# EAGLE design RaspiOMix+ (EAGLE 7.2.0)
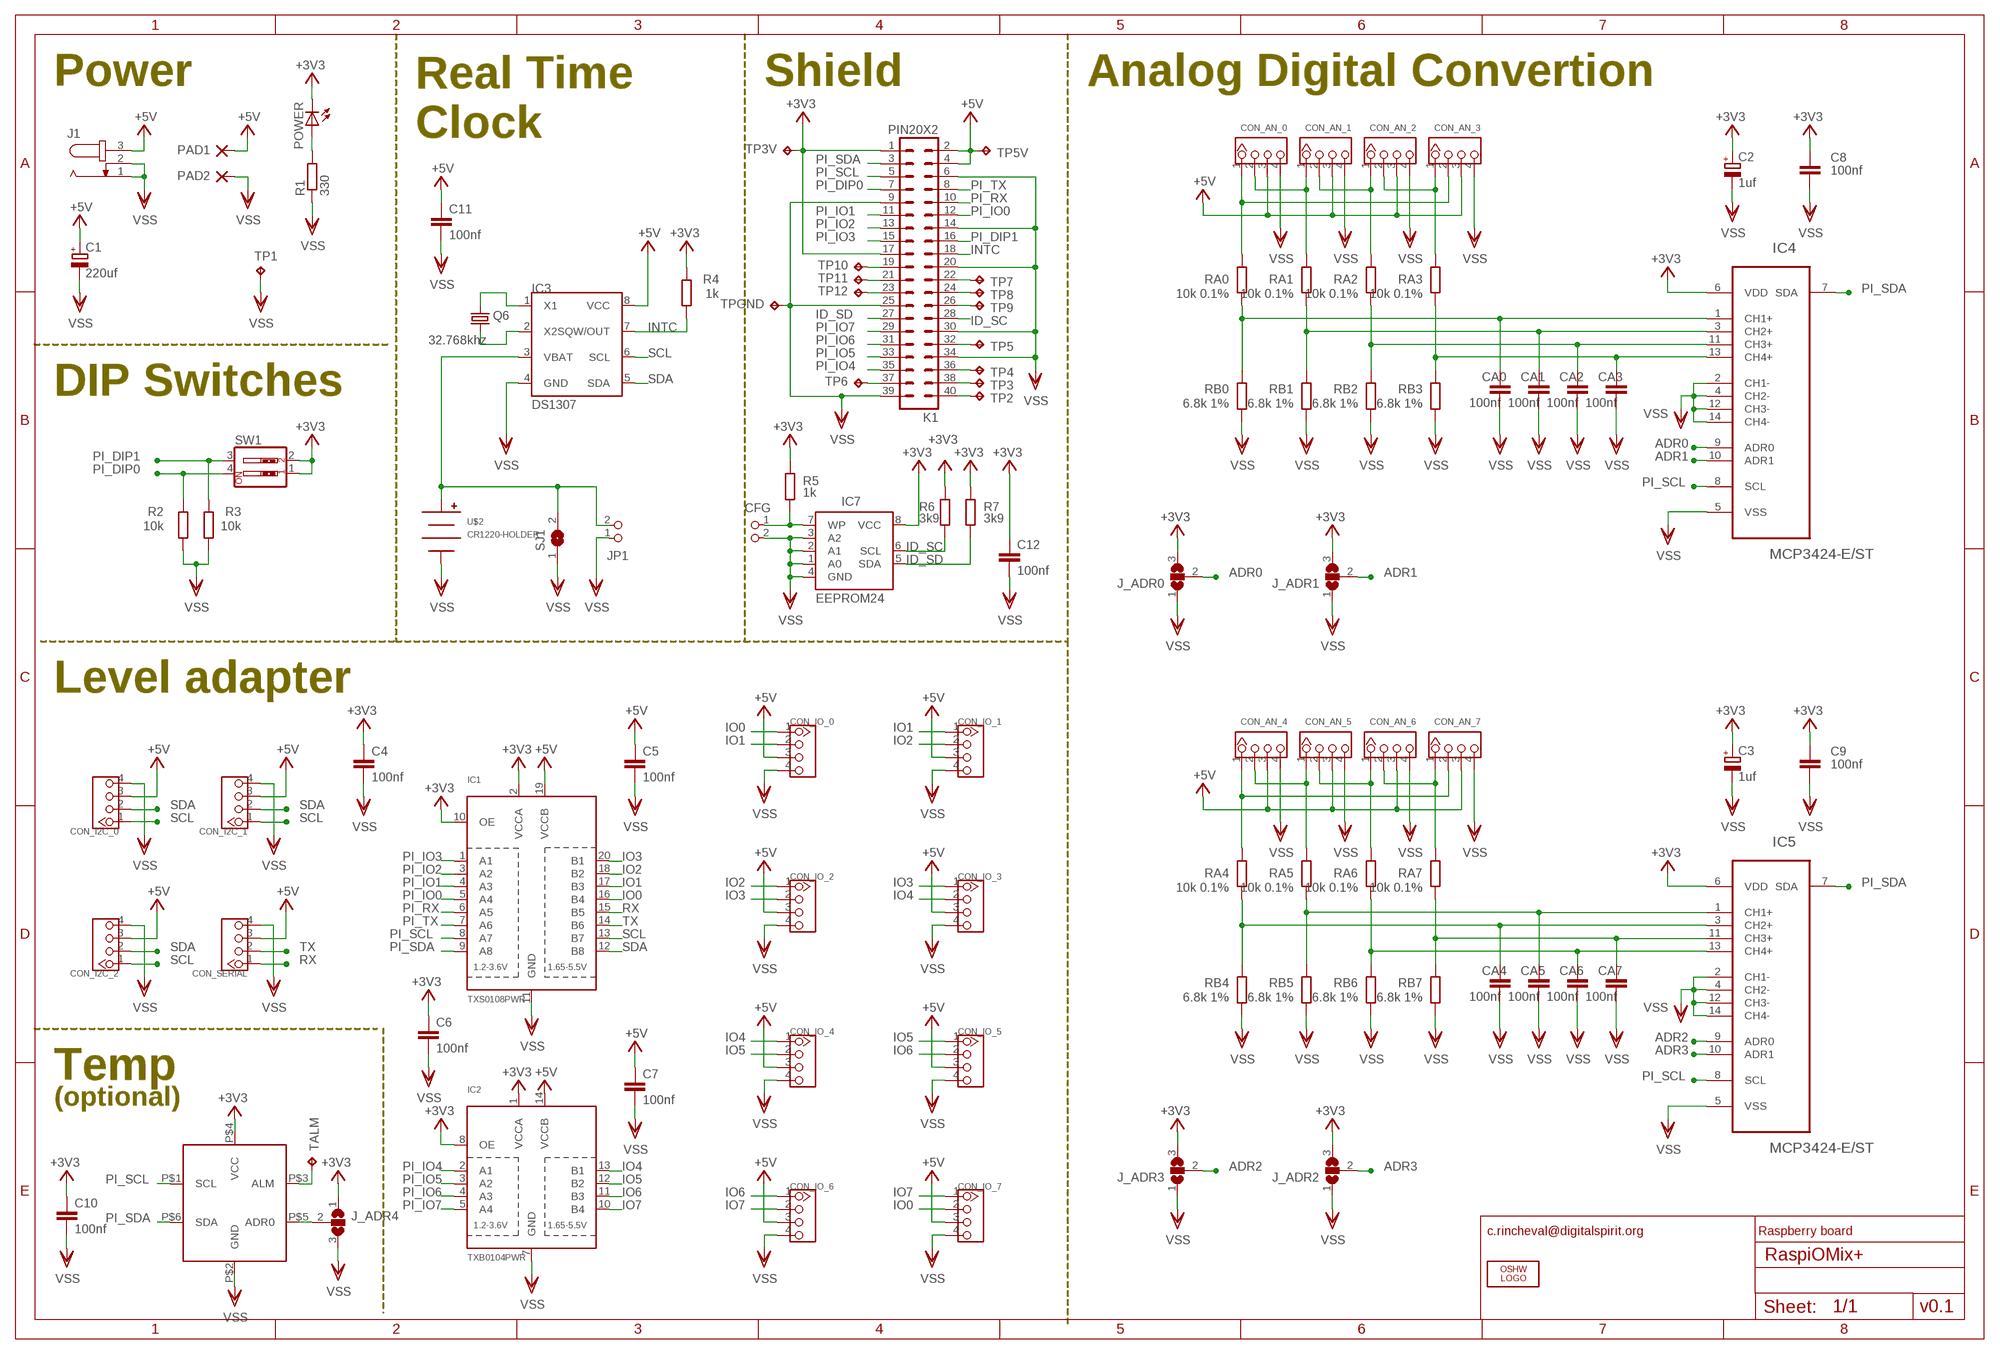
[diagram p0: schematic, sheet 1]

## Parts
C1  220uf  CPOL-EUD  [PANASONIC_D]
C2  1uf  CPOL-EUB/3528-21R  [B/3528-21R]
C3  1uf  CPOL-EUB/3528-21R  [B/3528-21R]
C4  100nf  C-EUC0805  [C0805]
C5  100nf  C-EUC0805  [C0805]
C6  100nf  C-EUC0805  [C0805]
C7  100nf  C-EUC0805  [C0805]
C8  100nf  C-EUC0805  [C0805]
C9  100nf  C-EUC0805  [C0805]
C10  100nf  C-EUC0805  [C0805]
C11  100nf  C-EUC0805  [C0805]
C12  100nf  C-EUC0805K  [C0805K]
CA0  100nf  C-EUC0805  [C0805]
CA1  100nf  C-EUC0805  [C0805]
CA2  100nf  C-EUC0805  [C0805]
CA3  100nf  C-EUC0805  [C0805]
CA4  100nf  C-EUC0805  [C0805]
CA5  100nf  C-EUC0805  [C0805]
CA6  100nf  C-EUC0805  [C0805]
CA7  100nf  C-EUC0805  [C0805]
CFG  PIN2_100  [PIN_W_2]
CON_AN_0  TWIG-4P-2.0-2.0  [4P-2.0]
CON_AN_1  TWIG-4P-2.0-2.0  [4P-2.0]
CON_AN_2  TWIG-4P-2.0-2.0  [4P-2.0]
CON_AN_3  TWIG-4P-2.0-2.0  [4P-2.0]
CON_AN_4  TWIG-4P-2.0-2.0  [4P-2.0]
CON_AN_5  TWIG-4P-2.0-2.0  [4P-2.0]
CON_AN_6  TWIG-4P-2.0-2.0  [4P-2.0]
CON_AN_7  TWIG-4P-2.0-2.0  [4P-2.0]
CON_I2C_0  TWIG-4P-2.0-2.0  [4P-2.0]
CON_I2C_1  TWIG-4P-2.0-2.0  [4P-2.0]
CON_I2C_2  TWIG-4P-2.0-2.0  [4P-2.0]
CON_IO_0  TWIG-4P-2.0-2.0  [4P-2.0]
CON_IO_1  TWIG-4P-2.0-2.0  [4P-2.0]
CON_IO_2  TWIG-4P-2.0-2.0  [4P-2.0]
CON_IO_3  TWIG-4P-2.0-2.0  [4P-2.0]
CON_IO_4  TWIG-4P-2.0-2.0  [4P-2.0]
CON_IO_5  TWIG-4P-2.0-2.0  [4P-2.0]
CON_IO_6  TWIG-4P-2.0-2.0  [4P-2.0]
CON_IO_7  TWIG-4P-2.0-2.0  [4P-2.0]
CON_SERIAL  TWIG-4P-2.0-2.0  [4P-2.0]
IC1  TXS0108PWR  TXB0108PWR  [TSSOP20]
IC2  TXB0104PWR  [TSSOP14]
IC3  DS1307  [SOIC-8]
IC4  MCP3424-E/ST  [SOP65P640X120-14N]
IC5  MCP3424-E/ST  [SOP65P640X120-14N]
IC6  TMP101  [SOT23-6]
IC7  EEPROM24  [SOIC8]
J1  JACK-PLUG0  [SPC4077]
J_ADR0  SJ2W  [SJ_2]
J_ADR1  SJ2W  [SJ_2]
J_ADR2  SJ2W  [SJ_2]
J_ADR3  SJ2W  [SJ_2]
J_ADR4  SJ2W  [SJ_2]
JP1  PIN2_100  [PIN_W_2]
K1  PIN20X2  [PIN_20X2]
LOGO1  OSHW_LOGO_FILLX0350-NT  [OSHW_FILLX350_NOTEXT]
PAD1  WIREPAD3,17/1,3  [3,17/1,3]
PAD2  WIREPAD3,17/1,3  [3,17/1,3]
POWER  LEDCHIPLED_0805  [CHIPLED_0805]
Q6  32.768khz  CRYSTALTC26H  [TC26H]
R1  330  R-EU_M0805  [M0805]
R2  10k  R-EU_M0805  [M0805]
R3  10k  R-EU_M0805  [M0805]
R4  1k  R-EU_M0805  [M0805]
R5  1k  R-EU_M0805  [M0805]
R6  3k9  R-EU_M0805  [M0805]
R7  3k9  R-EU_M0805  [M0805]
RA0  10k 0.1%  R-EU_M0805  [M0805]
RA1  10k 0.1%  R-EU_M0805  [M0805]
RA2  10k 0.1%  R-EU_M0805  [M0805]
RA3  10k 0.1%  R-EU_M0805  [M0805]
RA4  10k 0.1%  R-EU_M0805  [M0805]
RA5  10k 0.1%  R-EU_M0805  [M0805]
RA6  10k 0.1%  R-EU_M0805  [M0805]
RA7  10k 0.1%  R-EU_M0805  [M0805]
RB0  6.8k 1%  R-EU_M0805  [M0805]
RB1  6.8k 1%  R-EU_M0805  [M0805]
RB2  6.8k 1%  R-EU_M0805  [M0805]
RB3  6.8k 1%  R-EU_M0805  [M0805]
RB4  6.8k 1%  R-EU_M0805  [M0805]
RB5  6.8k 1%  R-EU_M0805  [M0805]
RB6  6.8k 1%  R-EU_M0805  [M0805]
RB7  6.8k 1%  R-EU_M0805  [M0805]
SJ1  SJ  [SJ]
SW1  SW_DIP-2  [EDG-02]
TALM  TPTP12R  [TP12R]
TP1  TPPAD1-13  [P1-13]
TP2  TPTP12R  [TP12R]
TP3  TPTP12R  [TP12R]
TP3V  TPTP12R  [TP12R]
TP4  TPTP12R  [TP12R]
TP5  TPTP12R  [TP12R]
TP5V  TPTP12R  [TP12R]
TP6  TPTP12R  [TP12R]
TP7  TPTP12R  [TP12R]
TP8  TPTP12R  [TP12R]
TP9  TPTP12R  [TP12R]
TP10  TPTP12R  [TP12R]
TP11  TPTP12R  [TP12R]
TP12  TPTP12R  [TP12R]
TPGND  TPTP12R  [TP12R]
U$2  CR1220-HOLDER  [HARWIN-CR1220]

## Nets
+3V3: C2.+ C3.+ C4.1 C6.1 C8.2 C9.2 C10.1 C12.1 IC1.2(VCCA) IC1.10(OE) IC2.1(VCCA) IC2.8(OE) IC4.6(VDD) IC5.6(VDD) IC6.P$4(VCC) IC7.8(VCC) J_ADR0.3 J_ADR1.3 J_ADR2.3 J_ADR3.3 J_ADR4.1 K1.1 K1.17 POWER.C R4.2 R5.2 R6.2 R7.2 SW1.1 SW1.2 TP3V.TP
+5V: C1.+ C5.1 C7.1 C11.1 CON_AN_0.3 CON_AN_1.3 CON_AN_2.3 CON_AN_3.3 CON_AN_4.3 CON_AN_5.3 CON_AN_6.3 CON_AN_7.3 CON_I2C_0.3 CON_I2C_1.3 CON_I2C_2.3 CON_IO_0.3 CON_IO_1.3 CON_IO_2.3 CON_IO_3.3 CON_IO_4.3 CON_IO_5.3 CON_IO_6.3 CON_IO_7.3 CON_SERIAL.3 IC1.19(VCCB) IC2.14(VCCB) IC3.8(VCC) J1.3 K1.2 K1.4 PAD1.1(P) TP5V.TP
ADR0: IC4.9(ADR0) J_ADR0.2
ADR1: IC4.10(ADR1) J_ADR1.2
ADR2: IC5.9(ADR0) J_ADR3.2
ADR3: IC5.10(ADR1) J_ADR2.2
AN0: CON_AN_0.1 CON_AN_3.2 RA0.2
AN1: CON_AN_0.2 CON_AN_1.1 RA1.2
AN2: CON_AN_1.2 CON_AN_2.1 RA2.2
AN3: CON_AN_2.2 CON_AN_3.1 RA3.2
AN4: CON_AN_4.1 CON_AN_7.2 RA4.2
AN5: CON_AN_4.2 CON_AN_5.1 RA5.2
AN6: CON_AN_5.2 CON_AN_6.1 RA6.2
AN7: CON_AN_6.2 CON_AN_7.1 RA7.2
ID_SC: IC7.6(SCL) K1.28 R6.1
ID_SD: IC7.5(SDA) K1.27 R7.1
INTC: IC3.7(SQW/OUT) K1.18 R4.1
IO0: CON_IO_0.1 CON_IO_7.2 IC1.16(B4)
IO1: CON_IO_0.2 CON_IO_1.1 IC1.17(B3)
IO2: CON_IO_1.2 CON_IO_2.1 IC1.18(B2)
IO3: CON_IO_2.2 CON_IO_3.1 IC1.20(B1)
IO4: CON_IO_3.2 CON_IO_4.1 IC2.13(B1)
IO5: CON_IO_4.2 CON_IO_5.1 IC2.12(B2)
IO6: CON_IO_5.2 CON_IO_6.1 IC2.11(B3)
IO7: CON_IO_6.2 CON_IO_7.1 IC2.10(B4)
N$1: K1.40 TP2.TP
N$2: K1.38 TP3.TP
N$3: CFG.1 IC7.7(WP) R5.1
N$4: CA3.1 IC4.13(CH4+) RA3.1 RB3.2
N$5: CA2.1 IC4.11(CH3+) RA2.1 RB2.2
N$6: CA1.1 IC4.3(CH2+) RA1.1 RB1.2
N$7: CA0.1 IC4.1(CH1+) RA0.1 RB0.2
N$8: CA7.1 IC5.11(CH3+) RA7.1 RB7.2
N$9: CA6.1 IC5.13(CH4+) RA6.1 RB6.2
N$10: CA5.1 IC5.1(CH1+) RA5.1 RB5.2
N$11: CA4.1 IC5.3(CH2+) RA4.1 RB4.2
N$12: K1.36 TP4.TP
N$13: K1.32 TP5.TP
N$14: K1.37 TP6.TP
N$15: K1.22 TP7.TP
N$16: K1.24 TP8.TP
N$17: K1.26 TP9.TP
N$18: K1.19 TP10.TP
N$19: K1.21 TP11.TP
N$20: K1.23 TP12.TP
N$21: IC6.P$5(ADR0) J_ADR4.2
N$22: IC6.P$3(ALM) TALM.TP
N$33: IC3.1(X1) Q6.1
N$34: IC3.2(X2) Q6.2
N$39: POWER.A R1.2
N$58: IC3.3(VBAT) JP1.2 SJ1.2 U$2.POS
PI_DIP0: K1.7 R2.2 SW1.4
PI_DIP1: K1.16 R3.2 SW1.3
PI_IO0: IC1.5(A4) K1.12
PI_IO1: IC1.4(A3) K1.11
PI_IO2: IC1.3(A2) K1.13
PI_IO3: IC1.1(A1) K1.15
PI_IO4: IC2.2(A1) K1.35
PI_IO5: IC2.3(A2) K1.33
PI_IO6: IC2.4(A3) K1.31
PI_IO7: IC2.5(A4) K1.29
PI_RX: IC1.6(A5) K1.10
PI_SCL: IC1.8(A7) IC4.8(SCL) IC5.8(SCL) IC6.P$1(SCL) K1.5
PI_SDA: IC1.9(A8) IC4.7(SDA) IC5.7(SDA) IC6.P$6(SDA) K1.3
PI_TX: IC1.7(A6) K1.8
RX: CON_SERIAL.1 IC1.15(B5)
SCL: CON_I2C_0.1 CON_I2C_1.1 CON_I2C_2.1 IC1.13(B7) IC3.6(SCL)
SDA: CON_I2C_0.2 CON_I2C_1.2 CON_I2C_2.2 IC1.12(B8) IC3.5(SDA)
TX: CON_SERIAL.2 IC1.14(B6)
VSS: C1.- C2.- C3.- C4.2 C5.2 C6.2 C7.2 C8.1 C9.1 C10.2 C11.2 C12.2 CA0.2 CA1.2 CA2.2 CA3.2 CA4.2 CA5.2 CA6.2 CA7.2 CFG.2 CON_AN_0.4 CON_AN_1.4 CON_AN_2.4 CON_AN_3.4 CON_AN_4.4 CON_AN_5.4 CON_AN_6.4 CON_AN_7.4 CON_I2C_0.4 CON_I2C_1.4 CON_I2C_2.4 CON_IO_0.4 CON_IO_1.4 CON_IO_2.4 CON_IO_3.4 CON_IO_4.4 CON_IO_5.4 CON_IO_6.4 CON_IO_7.4 CON_SERIAL.4 IC1.11(GND) IC2.7(GND) IC3.4(GND) IC4.2(CH1-) IC4.4(CH2-) IC4.5(VSS) IC4.12(CH3-) IC4.14(CH4-) IC5.2(CH1-) IC5.4(CH2-) IC5.5(VSS) IC5.12(CH3-) IC5.14(CH4-) IC6.P$2(GND) IC7.1(A0) IC7.2(A1) IC7.3(A2) IC7.4(GND) J1.1 J1.2 J_ADR0.1 J_ADR1.1 J_ADR2.1 J_ADR3.1 J_ADR4.3 JP1.1 K1.6 K1.9 K1.14 K1.20 K1.25 K1.30 K1.34 K1.39 PAD2.1(P) R1.1 R2.1 R3.1 RB0.1 RB1.1 RB2.1 RB3.1 RB4.1 RB5.1 RB6.1 RB7.1 SJ1.1 TP1.TP TPGND.TP U$2.NEG

## Notes on the sheet
- Power | Shield | Analog Digital Convertion
- Real Time
  Clock
- DIP Switches
- Level adapter
- Temp
- (optional)
- c.rincheval@digitalspirit.org | Raspberry board
- v0.1

## Library data of the parts
C1-C3 = rcl:CPOL-EU: POLARIZED CAPACITOR, European symbol
C4-C11 CA0 CA1-CA7 = rcl:C-EU: CAPACITOR, European symbol
C12 = resistor:C-EU: CAPACITOR, European symbol; DIELECTRIC: X7R
CFG JP1 = FLYFISH:PIN2
CON_AN_0 CON_AN_1-CON_AN_7 CON_I2C_0 CON_I2C_1 CON_I2C_2 CON_IO_0 CON_IO_1-CON_IO_7 CON_SERIAL = Seeedstudio_Connector:TWIG-4P-2.0
IC1 = adafruit:TXB0108PWR: 8-Bit Bi-Directional Level Shifter 1.2V-3.6V (VCCA) to 1.65V-5.5V (VCCB) bi-directional level shifter with auto direction sensing. Max data rate - VCCA 1.8V: 20Mbps (50ns), VCCA 3.3V: 100Mbps (10ns) Digikey: 296-21527-1-ND
IC2 = adafruit:TXB0104PWR: 4-Bit Bi-Directional Level Shifter 1.2V-3.6V (VCCA) to 1.65V-5.5V (VCCB) bi-directional level shifter with auto direction sensing. Max data rate - VCCA 1.8V: 20Mbps (50ns), VCCA 3.3V: 100Mbps (10ns) Digikey: 296-21929-1-ND
IC3 = eagleParts:DS1307: I2C Serial RTC w/56 bytes battery backed RAM
IC4 IC5 = eagleParts:MCP3424-E/ST: Analog-to-Digital Converter; MPN: MCP3424-E/ST; OC_FARNELL: 1630423; OC_NEWARK: 54M4872; PACKAGE: SOP-14; SUPPLIER: Microchip
IC6 = tmp10x:TMP101: Digital Temperature sensor from Texas Instruments Digital output : I2C Resolution : 9 to 12bit Accuracy : 2'C from -25'C to 85'C ; 3'C from -55'C to 125'C Supply : 2,7 to 5,5V / 45uA (standby 0,1uA) Alert output
IC7 = FLYFISH:EEPROM24
J1 = con-jack:JACK-PLUG: DC POWER JACK Power Jack, DC, Right Angle, Through Hole, Rated 5A at 16VDC, PC Terminals Distributor: Farnell (www.Farnell.de) Drawing: 84N1161.pdf / 84N1162.pdf Manufacturer: SPC Technology (www.spctechnology.com) Type: SPC4077 / SPC 4078; OC_FARNELL: unknown; OC_NEWARK: unknown
J_ADR0 J_ADR1-J_ADR4 = jumper:SJ2W: SMD solder JUMPER
K1 = FLYFISH:PIN20X2
LOGO1 = ohw-logo:OSHW_LOGO_FILL
PAD1 PAD2 = wirepad:WIREPAD: Wire PAD connect wire on PCB
POWER = led:LED: LED OSRAM: - CHIPLED LG R971, LG N971, LY N971, LG Q971, LY Q971, LO R971, LY R971 LH N974, LH R974 LS Q976, LO Q976, LY Q976 LO Q996 - Hyper CHIPLED LW Q18S LB Q993, LB Q99A, LB R99A - SideLED LS A670, LO A670, LY A670, LG A670, LP A670 LB A673, LV A673, LT A673, LW A673 LH A674 LY A675 LS A676, LA A676, LO A676, LY A676, LW A676 LS A679, LY A679, LG A679 - Hyper Micro SIDELED® LS Y876, LA Y876, LO Y876, LY Y876 LT Y87S - SmartLED LW L88C, LW L88S LB L89C, LB L89S, LG L890 LS L89K, LO L89K, LY L89K LS L896, LA L896, LO L896, LY L896 - TOPLED LS T670, LO T670, LY T670, LG T670, LP T670 LSG T670, LSP T670, LSY T670, LOP T670, LYG T670 LG T671, LOG T671, LSG T671 LB T673, LV T673, LT T673, LW T673 LH T674 LS T676, LA T676, LO T676, LY T676, LB T676, LH T676, LSB T676, LW T676 LB T67C, LV T67C, LT T67C, LS T67K, LO T67K, LY T67K, LW E67C LS E67B, LA E67B, LO E67B, LY E67B, LB E67C, LV E67C, LT E67C LW T67C LS T679, LY T679, LG T679 LS T770, LO T770, LY T770, LG T770, LP T770 LB T773, LV T773, LT T773, LW T773 LH T774 LS E675, LA E675, LY E675, LS T675 LS T776, LA T776, LO T776, LY T776, LB T776 LHGB T686 LT T68C, LB T68C - Hyper Mini TOPLED® LB M676 - Mini TOPLED Santana® LG M470 LS M47K, LO M47K, LY M47K Source: http://www.osram.convergy.de LUXEON: - LUMILED® LXK2-PW12-R00, LXK2-PW12-S00, LXK2-PW14-U00, LXK2-PW14-V00 LXK2-PM12-R00, LXK2-PM12-S00, LXK2-PM14-U00 LXK2-PE12-Q00, LXK2-PE12-R00, LXK2-PE12-S00, LXK2-PE14-T00, LXK2-PE14-U00 LXK2-PB12-K00, LXK2-PB12-L00, LXK2-PB12-M00, LXK2-PB14-N00, LXK2-PB14-P00, LXK2-PB14-Q00 LXK2-PR12-L00, LXK2-PR12-M00, LXK2-PR14-Q00, LXK2-PR14-R00 LXK2-PD12-Q00, LXK2-PD12-R00, LXK2-PD12-S00 LXK2-PH12-R00, LXK2-PH12-S00 LXK2-PL12-P00, LXK2-PL12-Q00, LXK2-PL12-R00 Source: www.luxeon.com KINGBRIGHT: KA-3528ASYC Source: www.kingbright.com
Q6 = crystal:CRYSTAL: CRYSTAL; OC_FARNELL: unknown; OC_NEWARK: unknown
R1-R4 RA0 RA1-RA7 RB0 RB1-RB7 = rcl:R-EU_: RESISTOR, European symbol
R5-R7 = resistor:R-EU_: RESISTOR, European symbol; TOLERANCE: 5%
SJ1 = jumper:SJ: SMD solder JUMPER
SW1 = special:SW_DIP-2: DIP SWITCH
TALM TP1-TP3 TP3V TP4 TP5 TP5V TP6-TP12 TPGND = testpad:TP: Test pad
U$2 = battery-holder:CR1220-HOLDER

## Board
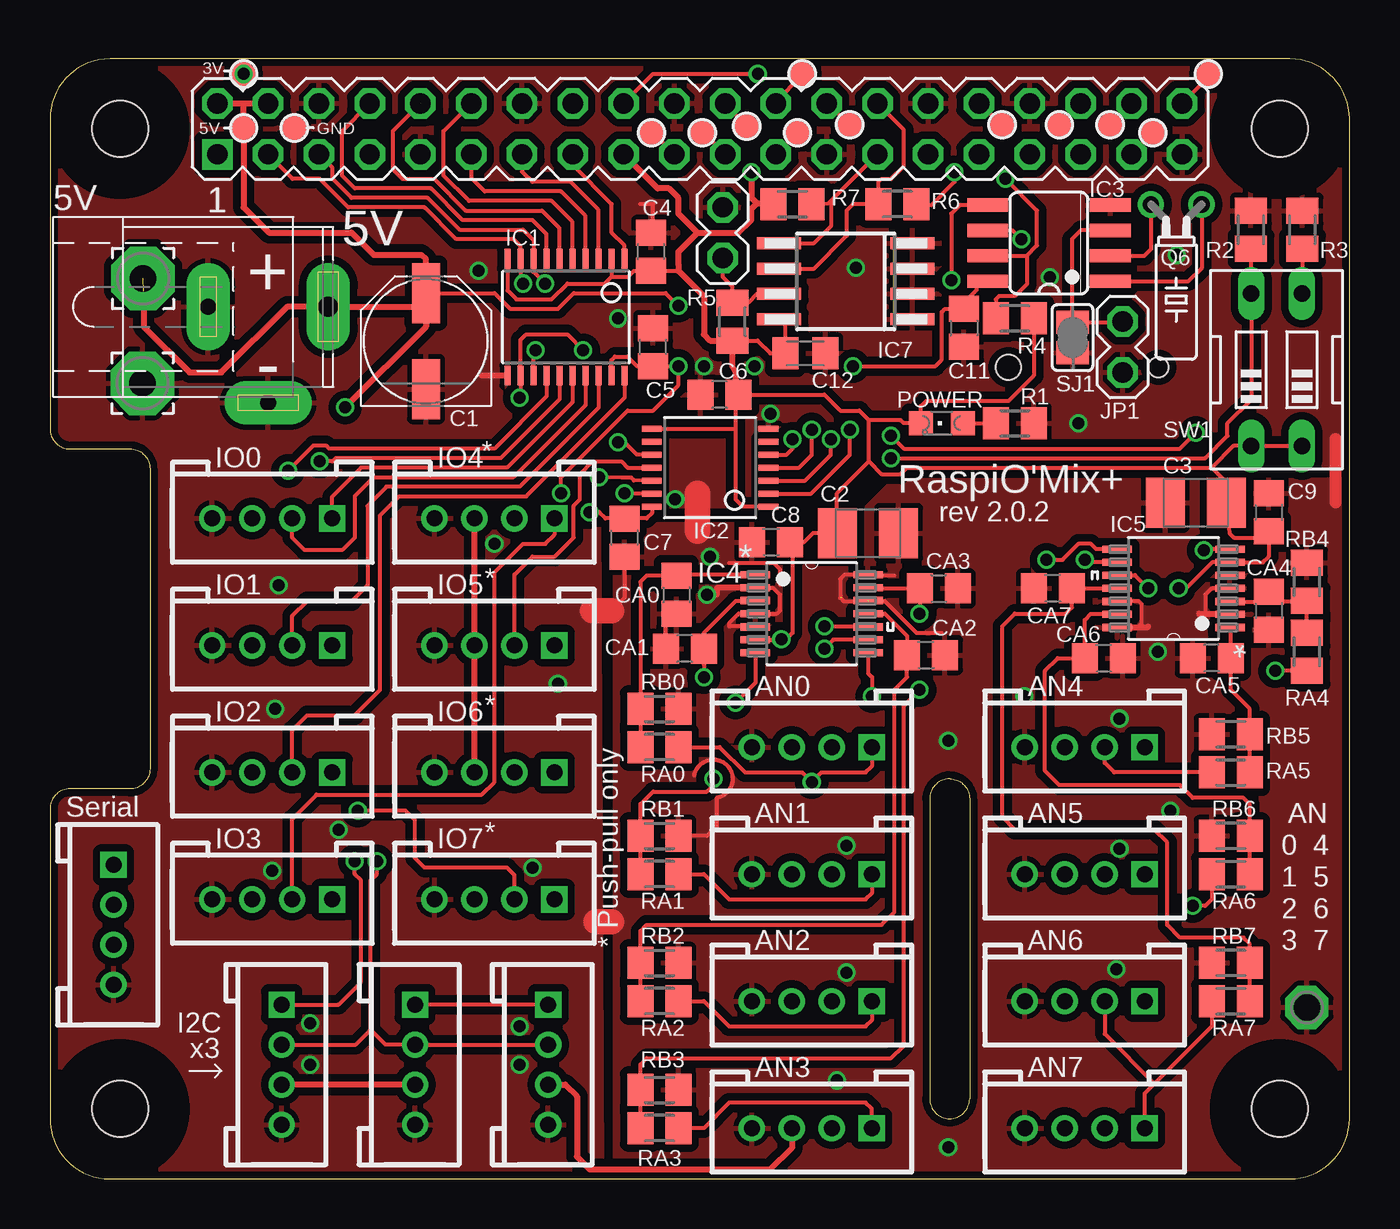
[diagram p1: board, top side]
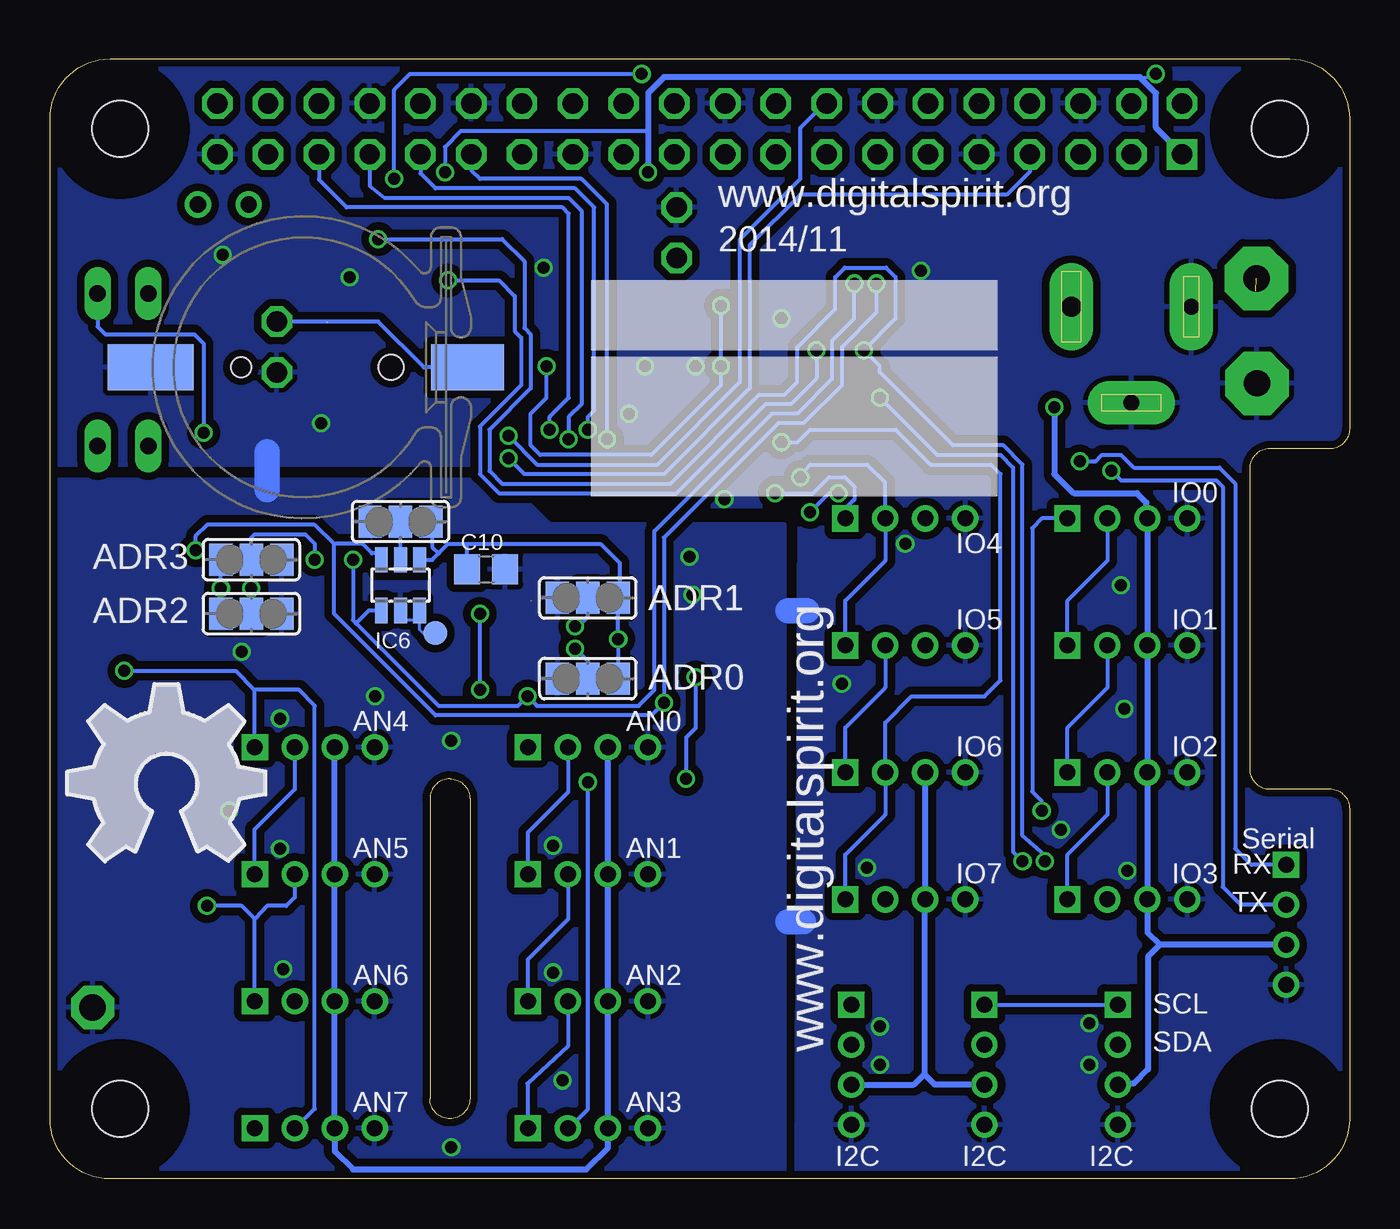
[diagram p2: board, bottom side, seen from below]

Size 65 x 56 mm. Coordinates in mm from the lower left corner, seen from the top.
Outline: 0,3 arc90 3,0 62,0 arc90 65,3 65,53 arc90 62,56 3,56 arc90 0,53 0,37.5 arc90 1,36.5 4,36.5 arc-90 5,35.5 5,20.5 arc-90 4,19.5 1,19.5 arc90 0,18.5 0,3
Outline: 44,19 44,4.01 arc180 46,4.01 46,19 arc90 45,20 arc90 44,19
Copper layers (1*16): Top 0.035mm / dielectric 1.5mm / Bottom 0.035mm
Design rules "SeeedStudio_2layer_DRU_no_angle_20140221": minimum track width 6mil, minimum drill 12mil, track to track 6mil, track to pad 6mil, pad to pad 6mil, via to via 6mil, smd to smd 0mil, copper to edge 10mil, drill to drill 10mil, minimum pad ring 10mil, minimum via ring 6mil, stop-mask expansion 2mil, vias tented up to drill 100mil, thermal gap 10mil
Holes 2.8 mm at 3.5,3.5 3.5,52.5 61.5,52.5 61.5,3.5
tRestrict: area 1.9,51 to 5,54; area 60,51 to 63,54; area 60,1.9 to 63,5; area 1.9,1.9 to 5,5
bRestrict: area 1.9,1.9 to 5,5; area 1.9,51 to 5,54; area 60,1.9 to 63,5; area 60,51 to 63,54

### Footprints (pad centres in the part's own frame; a part is rotated, then mirrored left to right if it is on the bottom)
PANASONIC_D = smd 3 x 1.4: + 2.4,0; - -2.4,0
B/3528-21R = smd 1.95 x 2.5: + 1.525,0; - -1.525,0
C0805 = smd 1.3 x 1.5: 1 -0.95,0; 2 0.95,0
C0805K = smd 1.3 x 1.6: 1 -1,0; 2 1,0
PIN_W_2 = drill 1.016 octagon: 1 0,0; 2 0,-2.54
4P-2.0 = drill 0.8 pad 1.27 square: 1 -3,0 | drill 0.8 pad 1.27: 2 -1,0; 3 1,0; 4 3,0
TSSOP20 = smd 0.305 x 0.991: 1 -2.925,-2.918; 2 -2.275,-2.918; 3 -1.625,-2.918; 4 -0.975,-2.918; 5 -0.325,-2.918; 6 0.325,-2.918; 7 0.975,-2.918; 8 1.625,-2.918; 9 2.275,-2.918; 10 2.925,-2.918; 11 2.925,2.918; 12 2.275,2.918; 13 1.625,2.918; 14 0.975,2.918; 15 0.325,2.918; 16 -0.325,2.918; 17 -0.975,2.918; 18 -1.625,2.918; 19 -2.275,2.918; 20 -2.925,2.918
TSSOP14 = smd 0.305 x 0.991: 1 -1.95,-2.918; 2 -1.3,-2.918; 3 -0.65,-2.918; 4 0,-2.918; 5 0.65,-2.918; 6 1.3,-2.918; 7 1.95,-2.918; 8 1.95,2.918; 9 1.3,2.918; 10 0.65,2.918; 11 0,2.918; 12 -0.65,2.918; 13 -1.3,2.918; 14 -1.95,2.918
SOIC-8 = smd 2.032 x 0.66: 1 -3.073,1.27; 2 -3.073,0; 3 -3.073,-1.27; 4 -3.073,-2.54; 5 3.073,-2.54; 6 3.073,-1.27; 7 3.073,0; 8 3.073,1.27
SOP65P640X120-14N = smd 1.473 x 0.356: 1 -2.819,1.956; 2 -2.819,1.295; 3 -2.819,0.66; 4 -2.819,0; 5 -2.819,-0.66; 6 -2.819,-1.295; 7 -2.819,-1.956; 8 2.819,-1.956; 9 2.819,-1.295; 10 2.819,-0.66; 11 2.819,0; 12 2.819,0.66; 13 2.819,1.295; 14 2.819,1.956
SOT23-6 = smd 0.635 x 1.27: P$1 -0.953,-1.27; P$2 0,-1.27; P$3 0.953,-1.27; P$4 0.953,1.27; P$5 0,1.27; P$6 -0.953,1.27
SOIC8 = smd 0.6 x 2.2: 1 -1.905,-3.33; 2 -0.635,-3.33; 3 0.635,-3.33; 4 1.905,-3.33; 5 1.905,3.33; 6 0.635,3.33; 7 -0.635,3.33; 8 -1.905,3.33
SPC4077 = drill 0.8 pad 2.184 long: 1 -3,0; 2 0,-4.8 | drill 1 pad 2.184 long: 3 3,0
SJ_2 = smd 1.168 x 1.6: 1 -1.524,0; 2 0,0; 3 1.524,0
PIN_20X2 = drill 1.016 square: 1 -24.13,-1.27 | drill 1.016 octagon: 2 -24.13,1.27; 3 -21.59,-1.27; 4 -21.59,1.27; 5 -19.05,-1.27; 6 -19.05,1.27; 7 -16.51,-1.27; 8 -16.51,1.27; 9 -13.97,-1.27; 10 -13.97,1.27; 11 -11.43,-1.27; 12 -11.43,1.27; 13 -8.89,-1.27; 14 -8.89,1.27; 15 -6.35,-1.27; 16 -6.35,1.27; 17 -3.81,-1.27; 18 -3.81,1.27; 19 -1.27,-1.27; 20 -1.27,1.27; 21 1.27,-1.27; 22 1.27,1.27; 23 3.81,-1.27; 24 3.81,1.27; 25 6.35,-1.27; 26 6.35,1.27; 27 8.89,-1.27; 28 8.89,1.27; 29 11.43,-1.27; 30 11.43,1.27; 31 13.97,-1.27; 32 13.97,1.27; 33 16.51,-1.27; 34 16.51,1.27; 35 19.05,-1.27; 36 19.05,1.27; 37 21.59,-1.27; 38 21.59,1.27; 39 24.13,-1.27; 40 24.13,1.27
3,17/1,3 = drill 1.321 pad 3.175 octagon: 1 0,0
CHIPLED_0805 = smd 1.2 x 1.2: A 0,-1.05; C 0,1.05
TC26H = drill 0.813: 1 -1.27,0; 2 1.27,0
M0805 = smd 1.3 x 1.6: 1 -0.95,0; 2 0.95,0
SJ = smd 1.168 x 1.6: 1 -0.762,0; 2 0.762,0
EDG-02 = drill 0.813 long: 1 -1.27,-3.81; 2 1.27,-3.81; 3 1.27,3.81; 4 -1.27,3.81
TP12R = smd 1.2 x 1.2: TP 0,0
P1-13 = drill 1.321 pad 2.159 octagon: TP 0,0
HARWIN-CR1220 = smd 2.3 x 4.3: NEG 0,8.26 | smd 2.3 x 3.66: POS 0,-7.58 | hole 1: 0,3.75 | hole 1.25: 0,-3.75

### Placement (x,y rotation side)
C1  18.8,41.88 90 top
C2  40.92,32.29 180 top
C3  57.31,33.81 0 top
C4  30.07,46.35 90 top
C5  30.16,41.59 90 top
C6  33.5,39.21 180 top
C7  28.73,32.07 270 top
C8  36.07,31.84 0 top
C9  60.96,33.34 270 top
C10  43.18,30.48 0 bottom
C11  45.72,42.55 270 top
C12  37.78,41.27 0 top
CA0  31.34,29.21 270 top
CA1  31.75,26.51 180 top
CA2  43.81,26.19 0 top
CA3  44.45,29.53 0 top
CA4  60.96,28.42 270 top
CA5  58.1,26.04 180 top
CA6  52.7,26.04 0 top
CA7  50.16,29.53 180 top
CFG  33.66,46.04 180 top
CON_AN_0  38.1,21.59 180 top
CON_AN_1  38.1,15.24 180 top
CON_AN_2  38.1,8.89 180 top
CON_AN_3  38.1,2.54 180 top
CON_AN_4  51.75,21.59 180 top
CON_AN_5  51.75,15.24 180 top
CON_AN_6  51.75,8.89 180 top
CON_AN_7  51.75,2.54 180 top
CON_I2C_0  11.59,5.71 270 top
CON_I2C_1  18.26,5.71 270 top
CON_I2C_2  24.92,5.71 270 top
CON_IO_0  11.11,33.02 180 top
CON_IO_1  11.11,26.67 180 top
CON_IO_2  11.11,20.32 180 top
CON_IO_3  11.11,13.97 180 top
CON_IO_4  22.23,33.02 180 top
CON_IO_5  22.23,26.67 180 top
CON_IO_6  22.23,20.32 180 top
CON_IO_7  22.23,13.97 180 top
CON_SERIAL  3.17,12.7 270 top
IC1  25.81,43.09 180 top
IC2  33.02,35.56 90 top
IC3  49.97,46.15 180 top
IC4  38.1,28.26 0 top
IC5  56.2,29.53 180 top
IC6  47.47,29.69 0 bottom
IC7  39.8,44.88 90 top
J1  10.91,43.6 0 top
J_ADR0  38.1,25.02 0 bottom
J_ADR1  38.1,29.05 0 bottom
J_ADR2  54.93,28.26 180 bottom
J_ADR3  54.93,30.96 180 bottom
J_ADR4  47.47,32.86 180 bottom
JP1  53.66,40.32 180 top
K1  32.5,52.5 0 top
LOGO1  64.14,15.88 0 bottom
PAD1  4.66,45.02 0 top
PAD2  4.63,39.78 0 top
POWER  44.61,37.78 90 top
Q6  56.33,48.72 180 top
R1  48.26,37.78 180 top
R2  60.07,47.47 270 top
R3  62.64,47.47 270 top
R4  48.26,43.02 0 top
R5  34.13,42.86 270 top
R6  42.39,48.74 0 top
R7  37.15,48.74 180 top
RA0  30.48,21.59 0 top
RA1  30.48,15.24 0 top
RA2  30.48,8.89 0 top
RA3  30.48,2.54 0 top
RA4  62.87,26.35 270 top
RA5  59.05,20.32 180 top
RA6  59.05,15.24 180 top
RA7  59.05,8.89 180 top
RB0  30.48,23.5 180 top
RB1  30.48,17.14 180 top
RB2  30.48,10.79 180 top
RB3  30.48,4.45 180 top
RB4  62.87,29.84 270 top
RB5  59.05,22.23 0 top
RB6  59.05,17.14 0 top
RB7  59.05,10.79 0 top
SJ1  51.15,42.07 90 top
SW1  61.35,40.46 0 top
TALM  45.72,27.3 0 bottom
TP1  62.87,8.57 0 top
TP2  57.94,55.24 0 top
TP3  53.02,52.7 0 top
TP3V  9.68,55.24 0 top
TP4  50.48,52.7 0 top
TP5  47.62,52.7 0 top
TP5V  9.68,52.55 0 top
TP6  55.17,52.31 0 top
TP7  34.85,52.63 0 top
TP8  37.62,55.24 0 top
TP9  40.01,52.7 0 top
TP10  30.08,52.31 0 top
TP11  32.62,52.31 0 top
TP12  37.39,52.31 0 top
TPGND  12.22,52.55 0 top
U$2  51.7,40.58 90 bottom

### Tracks (layer width: path | path; a pad name or v marks a point on that pad's centre or on a via)
+3V3  (via drill 0.6)
  Top 0.203: SW1.2 SW1.1 59.19,36.65 58.1,35.56 | v45.24,50.32 45.24,49.85 44.09,48.69 R6.2 | IC4.6 36.55,26.96 v36.58,26.99 36.83,26.99 37.15,27.3 37.15,31.75 37.02,31.88 C8.2 37.72,31.84 38.16,32.29 C2.+ 39.37,32 39.37,34.29 40.96,35.88 | 31.43,45.72 31.43,45.41 C4.1 29.21,45.4 28.91,45.1 28.08,45.1 | IC1.2 28.08,45.1 | IC1.10 22.88,44.43 23.34,43.97 25.08,43.97 25.88,44.77 27.75,44.77 28.08,45.1 | 34.29,37.47 34.29,39.05 C6.1 38.73,39.21 39.53,38.42 40.48,38.42 40.96,37.94 | 34.29,37.47 34.29,33.97 34.65,33.61 IC2.1 | IC2.8 34.24,37.51 34.29,37.47 | 58.1,35.56 42.86,35.56 42.55,35.24 41.59,35.24 40.96,35.88 | R5.2 35.4,41.91 36.04,41.27 C12.1 36.78,42.97 IC7.8 | 40.96,37.94 42.55,37.94 42.7,37.78 POWER.C 43.56,38.64 43.81,38.89 47.94,38.89 49.21,40.16 R4.2 | 40.96,35.88 40.96,37.94 | 58.1,35.56 58.67,34.99 58.67,33.72 58.74,33.66 C3.+ 58.99,32.29 59.21,32.07 60.96,32.07 C9.2 60.96,31.11 60.67,30.82 IC5.6 58.13,30.82 56.83,29.53 v56.45,29.53
  Top 0.305: 36.59,42.86 IC7.8 | 34.29,39.05 34.29,40.32 34.13,40.64 R5.2 33.65,41.91 33.02,41.91 32.7,42.23 32.7,44.13 31.43,45.4 31.43,45.72 31.43,46.35 32.38,47.31 | 32.38,47.31 34.45,47.31 35.08,47.94 35.08,48.51 35.35,48.78 | v35.08,50.32 35.08,49.05 35.35,48.78 | 35.35,48.78 36.15,48.78 R7.2 | 32.38,47.31 31.43,48.26 31.43,49.05 30.96,49.53 30.39,49.53 K1.17
  Bottom 0.152: 10.48,55.09 9.84,55.09 TP3V.TP
  Bottom 0.203: J_ADR0.3 v36.58,26.99 J_ADR1.3 36.51,29.11 36.51,30.8 37.47,31.75 44.13,31.75 | v56.45,29.53 J_ADR2.3 J_ADR3.3 | 45.09,31.75 44.13,31.75 | IC6.P$4 45.88,30.96 45.56,31.27 | 45.56,31.27 45.09,31.75 | 45.08,31.75 45.09,31.75 | C10.1 44.13,31.75 | J_ADR4.1 45.88,32.7 45.88,31.59 45.56,31.27 | v35.08,50.32 35.08,52.39 44.45,52.39 45.24,51.59 v45.24,50.32
  Bottom 0.305: K1.1 9.68,52.55 9.68,54.29 10.48,55.09 34.29,55.09 35.08,54.29 v35.08,50.32
  other vias: 9.68,55.24
+5V  (via drill 0.6)  (1 unrouted)
  Top 0.203: IC3.8 46.35,44.82 46.35,44.45 46.04,44.13 C11.1 45.88,43.5 44.77,43.5 44.61,43.34 44.61,40.96 44.29,40.64 v40.16,40.64 | IC2.14 30.1,33.28 29.84,33.02 C7.1 | C7.1 | C7.1 27.78,33.02 27.46,33.34 v26.99,33.34 | 28.08,40.31 IC1.19 28.08,40.94 28.26,41.12 28.89,41.12 29.37,40.64 C5.1 v31.43,40.64 31.43,39.69 30.16,38.42 28.89,38.42 25.56,35.08 v25.56,34.29 | v31.43,43.65 v31.43,43.66 30.8,44.29 26.19,44.29 25.4,43.5 23.02,43.5 22.23,44.28 C1.+
  Top 0.305: K1.2 9.68,53.77 | 9.68,53.77 K1.4 | 4.7,44.38 4.7,42.61 6.99,40.32 8.57,40.32 11.86,43.6 J1.3 18.69,43.6 18.8,43.5 | v14.76,38.58 18.8,42.61 18.8,43.5 | 18.8,43.5 C1.+ 18.8,45.97 18.57,46.2 16.19,46.2 15.08,47.31 10.95,47.31 9.68,48.58 TP5V.TP 9.68,53.77 | CON_I2C_2.3 25.77,4.71 26.35,4.13 26.35,1.11 26.99,0.48 36.04,0.48 37.1,1.54 CON_AN_3.3 | CON_I2C_1.3 CON_I2C_0.3 | CON_IO_6.3 CON_IO_5.3 CON_IO_4.3
  Bottom 0.203: v40.16,40.64 40.16,39.05 40.96,38.26 40.96,36.67 40.48,36.2 34.92,36.2 31.43,39.69 v31.43,40.64 v31.43,43.66 | v25.56,34.29 26.04,34.29 v26.99,33.34
  Bottom 0.305: v14.76,38.58 14.76,35.24 13.81,34.29 10.64,34.29 10.16,33.81 10.16,33.07 CON_IO_0.3 CON_IO_1.3 CON_IO_2.3 CON_IO_3.3 10.11,12.32 9.49,11.7 | CON_IO_6.3 CON_IO_7.3 21.27,13.92 21.27,5.24 | CON_I2C_0.3 11.54,4.76 10.79,4.76 10.08,5.48 10.08,11.11 9.49,11.7 | CON_SERIAL.3 9.49,11.7 | CON_AN_0.3 CON_AN_1.3 CON_AN_2.3 CON_AN_3.3 37.1,1.54 38.16,0.48 49.85,0.48 50.75,1.38 CON_AN_7.3 CON_AN_6.3 CON_AN_5.3 CON_AN_4.3 | CON_I2C_1.3 20.75,4.71 21.27,5.24 | CON_I2C_2.3 21.8,4.71 21.27,5.24
ADR0  (via drill 0.6)
  Top 0.203: IC4.9 39.19,26.96 v38.73,26.51
  Bottom 0.203: v38.73,26.51 38.1,25.88 J_ADR0.2
ADR1  (via drill 0.6)
  Top 0.203: IC4.10 38.92,27.6 v38.73,27.62
  Bottom 0.203: v38.73,27.62 38.58,27.62 38.1,28.1 J_ADR1.2
ADR2  (via drill 0.6)
  Top 0.203: IC5.9 51.89,30.82 v51.75,30.96
  Bottom 0.203: v51.75,30.96 51.75,31.75 52.23,32.23 54.77,32.23 54.93,32.07 J_ADR3.2
ADR3  (via drill 0.6)
  Top 0.203: IC5.10 54.27,30.19 v54.93,29.53
  Bottom 0.203: v54.93,29.53 J_ADR2.2
AN0  (via drill 0.6)
  Top 0.203: RA0.2 33.5,21.59 34.77,20.32 37.62,20.32 v38.1,19.84 38.58,20.32 40.8,20.32 41.1,20.62 CON_AN_0.1
  Bottom 0.203: CON_AN_3.2 39.1,2.49 38.1,3.49 v38.1,19.84
AN1
  Top 0.203: RA1.2 32.7,15.24 33.97,13.97 40.8,13.97 41.1,14.27 CON_AN_1.1
  Bottom 0.203: CON_AN_1.1 41.1,17.32 39.1,19.32 CON_AN_0.2
AN2
  Top 0.203: RA2.2 32.7,8.89 33.97,7.62 40.8,7.62 41.1,7.92 CON_AN_2.1
  Bottom 0.203: CON_AN_2.1 41.1,10.97 39.1,12.97 CON_AN_1.2
AN3
  Top 0.203: CON_AN_3.1 41.1,3.51 40.8,3.81 33.97,3.81 32.7,2.54 RA3.2
  Bottom 0.203: CON_AN_2.2 39.1,6.62 41.12,4.76 41.12,2.84 CON_AN_3.1
AN4  (via drill 0.6)
  Top 0.203: RA4.2 v61.28,25.4
  Top 0.305: RA4.2
  Bottom 0.203: CON_AN_7.2 51.8,3.49 51.75,3.49 51.75,23.65 52.55,24.45 54.74,24.45 54.75,24.43 | CON_AN_4.1 54.75,24.43 | 54.75,24.43 55.72,25.4 v61.28,25.4
AN5
  Top 0.203: CON_AN_4.2 52.75,20.8 53.23,20.32 RA5.2
  Bottom 0.203: CON_AN_5.1 54.75,17.48 52.75,19.48 CON_AN_4.2
AN6  (via drill 0.6)
  Top 0.203: RA6.2 58.1,13.97 57.78,13.65 v57.15,13.65
  Bottom 0.203: CON_AN_6.1 54.75,13 | 54.75,13 55.4,13.65 v57.15,13.65 | 54.75,13 54.74,13.02 54.13,13.65 53.18,13.65 52.75,14.08 CON_AN_5.2
AN7
  Top 0.203: RA7.2 58.1,7.62 55.24,4.76 | CON_AN_7.1 54.75,4.27 55.24,4.76 | CON_AN_6.2 52.75,7.25 55.24,4.76
ID_SC
  Top 0.203: K1.28 42.7,52.46 42.7,50.64 42.07,50.01 41.59,50.01 41.44,49.85 R6.1 40.16,48.74 39.85,48.42 39.85,47.15 38.21,45.52 IC7.6
ID_SD
  Top 0.203: K1.27 39.05,48.9 | 39.05,48.9 39.05,47.62 38.21,46.78 IC7.5 | R7.1 38.94,48.78 39.05,48.9
INTC  (via drill 0.6)
  Top 0.203: K1.18 30.16,55.24 v35.4,55.24 | v47.78,50.01 49.37,48.42 49.37,46.67 48.85,46.15 | IC3.7 48.85,46.15 | R4.1 47.31,42.87 47.31,43.97 47.47,44.13 48.26,44.13 48.85,44.72 48.85,46.15
  Bottom 0.203: v47.78,50.01 47.78,54.45 46.99,55.24 v35.4,55.24
IO0  (via drill 0.6)
  Top 0.203: IC1.16 26.13,38.83 22.86,35.56 15.56,35.56 14.11,34.12 CON_IO_0.1 | CON_IO_7.2 23.23,15.19 22.86,15.56 18.73,15.56 18.26,16.03 18.26,17.94 17.78,18.41 v15.4,18.41
  Bottom 0.203: CON_IO_0.1 15.4,33.02 15.88,32.54 15.88,19.37 15.4,18.89 v15.4,18.41
IO1
  Top 0.203: IC1.17 26.78,38.69 23.18,35.08 16.19,35.08 15.24,34.13 15.24,32.07 14.61,31.43 12.75,31.43 12.11,32.07 CON_IO_0.2
  Bottom 0.203: CON_IO_1.1 14.11,28.91 12.11,30.91 CON_IO_0.2
IO2
  Top 0.203: IC1.18 27.43,38.55 23.5,34.61 16.83,34.61 15.88,33.66 15.88,29.69 15.08,28.89 12.86,28.89 12.11,28.15 CON_IO_1.2
  Bottom 0.203: CON_IO_2.1 14.11,22.56 12.11,24.56 CON_IO_1.2
IO3
  Top 0.203: IC1.20 28.73,39.05 23.81,34.13 17.46,34.13 16.51,33.18 16.51,24.45 15.24,23.18 12.86,23.18 12.11,22.43 CON_IO_2.2
  Bottom 0.203: CON_IO_3.1 14.11,16.21 12.11,18.21 CON_IO_2.2
IO4  (via drill 0.6)
  Top 0.203: IC2.13 28.76,34.26 v28.73,34.29 | CON_IO_3.2 12.11,17.99 13.34,19.21 21.59,19.21 22.23,19.84 22.23,30.32 23.65,31.75 24.77,31.75 25.23,32.21 CON_IO_4.1
  Bottom 0.203: v28.73,34.29 26.83,34.29 26.04,35.08 25.24,35.08 24.77,34.61 24.77,33.96 24.78,33.96 25.24,33.5 CON_IO_4.1
IO5  (via drill 0.6)
  Top 0.203: IC2.12 29.21,34.92 29.07,35.07 28.59,35.07 v27.46,35.08
  Bottom 0.203: v27.46,35.08 26.99,35.72 24.13,35.72 23.23,34.81 CON_IO_4.2 23.23,30.91 25.23,28.91 CON_IO_5.1
IO6
  Top 0.203: IC2.11 28.89,35.56 28.57,35.88 27.15,35.88 26.51,35.24 26.51,33.97 26.19,33.66 26.19,32.07 25.24,31.11 24.13,31.11 23.23,30.21 CON_IO_5.2
  Bottom 0.203: CON_IO_6.1 25.23,22.56 23.23,24.56 CON_IO_5.2
IO7  (via drill 0.6)
  Top 0.203: IC2.10 29.35,36.21 28.73,36.83 v28.42,36.83
  Bottom 0.203: v28.42,36.83 27.62,36.83 26.99,37.47 22.7,37.47 20.95,35.72 17.94,35.72 17.46,35.24 17.46,24.92 18.26,24.13 21.91,24.13 23.23,22.81 CON_IO_6.2 23.23,18.21 25.23,16.21 CON_IO_7.1
N$1
  Top 0.203: K1.40 57.94,55.09 TP2.TP
  Bottom 0.203: K1.40
N$2
  Top 0.203: K1.38 TP3.TP
N$3
  Top 0.203: R5.1 34.13,44.61 33.66,45.09 CFG.1 | IC7.7 35.35,44.24 34.92,43.81 33.66,43.81
  Top 0.305: 33.66,43.81 R5.1
N$4  (via drill 0.6)
  Top 0.203: v43.5,24.45 42.7,23.65 42.7,6.67 42.07,6.03 29.84,6.03 29.53,5.72 RB3.2 RA3.1 | v43.5,28.26 CA3.1 40.63,29.53
  Top 0.305: 40.63,29.53 IC4.13 | 43.5,29.37 CA3.1
  Bottom 0.203: v43.5,24.45 v43.5,28.26
N$5
  Top 0.203: IC4.11 41.75,28.26 42.86,27.15 CA2.1 42.86,25.08 42.23,24.45 42.23,13.34 41.59,12.7 29.84,12.7 29.53,12.38 RB2.2 RA2.1
  Top 0.305: 42.55,25.88 CA2.1
N$6  (via drill 0.6)
  Top 0.203: v32.7,25.08 32.7,25.72 CA1.1 32.7,25.88 32.7,27.3 34.29,28.89 35.26,28.89 | RA1.1 RB1.2 | RB1.2 29.53,18.73 30.16,19.37 32.86,19.37 33.18,19.68 v33.18,20
  Top 0.305: 35.26,28.89 IC4.3 | RB1.2 | 33.02,26.19 CA1.1
  Bottom 0.203: v32.7,25.08 32.7,22.54 33.18,22.07 v33.18,20
N$7
  Top 0.203: RB0.2 29.53,29.84 29.84,30.16 CA0.1 31.39,30.21 IC4.1 | RB0.2 RA0.1
  Top 0.305: RB0.2
N$8
  Top 0.203: RA7.1 RB7.2 60.01,11.75 59.69,12.06 56.52,12.06 55.88,12.7 55.88,16.83 55.24,17.46 48.26,17.46 47.62,18.1 47.62,27.62 48.26,28.26 50.8,28.26 51.12,28.57 CA7.1 | CA7.1 IC5.11
  Top 0.305: CA7.1
N$9
  Top 0.203: RA6.1 RB6.2 60.01,18.73 59.69,19.05 57.15,19.05 56.52,19.68 50.48,19.68 49.77,20.4 49.77,25.4 50.4,26.04 CA6.1 51.76,27.94 | 51.76,27.94 51.75,27.94 | IC5.13 52.05,28.23 51.76,27.94
N$10
  Top 0.203: RA5.1 RB5.2 | RB5.2 60.01,23.5 59.05,24.45 CA5.1 59.05,27.54
  Top 0.305: RB5.2 | 59.05,27.54 IC5.1
N$11
  Top 0.203: RA4.1 RB4.2 61.59,28.89 60.96,29.52 CA4.1 60.3,28.87 IC5.3
N$12
  Top 0.203: K1.36 TP4.TP
N$13
  Top 0.203: K1.32 TP5.TP
N$14
  Top 0.203: K1.37 TP6.TP
  Bottom 0.203: K1.37
N$15
  Top 0.203: K1.22 TP7.TP
N$16
  Top 0.203: K1.24 TP8.TP
N$17
  Top 0.203: K1.26 TP9.TP
N$18
  Top 0.203: TP10.TP 30.23,52.23 K1.19
N$19
  Top 0.203: K1.21 32.77,52.23 TP11.TP
N$20
  Top 0.203: TP12.TP 37.31,52.23 K1.23
N$21
  Bottom 0.203: IC6.P$5 J_ADR4.2
N$22
  Bottom 0.152: TALM.TP 46.35,27.3 46.51,27.46 IC6.P$3
N$23
  Bottom 0.152: 46.35,32.86 46.99,32.86
N$24
  Bottom 0.152: 36.99,29.05 37.62,29.05
N$25
  Bottom 0.152: 46.67,27.94 47.31,27.94
N$26
  Bottom 0.152: 36.99,25.08 37.62,25.08
N$27
  Bottom 0.152: 53.82,30.96 54.61,30.96
N$28
  Bottom 0.152: 55.24,28.26 56.04,28.26
N$33
  Top 0.203: Q6.1 57.6,45.54 56.95,44.88 IC3.1
N$34
  Top 0.203: IC3.2 54.73,46.15 55.06,46.49 Q6.2
N$39
  Top 0.203: POWER.A R1.2
N$58  (1 unrouted)
  Top 0.203: IC3.3 51.55,47.42 51.12,46.99 51.12,42.86 | SJ1.2 53.62,42.83 JP1.2
  Bottom 0.203: JP1.2 48.58,42.86 46.29,40.58 U$2.POS
PI_DIP0  (via drill 0.6)
  Top 0.203: v42.07,36.04 57.78,36.04 58.9,37.15 58.9,37.78 60.08,38.97 SW1.4 R2.2
  Bottom 0.203: K1.7 15.99,50.37 17.14,49.21 27.46,49.21 30,46.67 30,39.53 34.29,35.24 41.27,35.24 v42.07,36.04
PI_DIP1  (via drill 0.6)
  Top 0.203: v42.07,37.15 42.7,36.51 56.52,36.51 v57.31,37.31 | R3.2 62.64,44.29 SW1.3
  Bottom 0.203: v42.07,37.15 40.64,35.72 34.61,35.72 30.48,39.85 30.48,46.99 27.46,50.01 27.46,52.55 26.24,53.77 K1.16 | SW1.3 62.62,42.62 62.23,42.23 57.78,42.23 57.31,41.75 v57.31,37.31
PI_IO0
  Top 0.203: IC1.5 26.13,47.84 25.08,48.9 20.95,48.9 19.68,50.16 19.68,52.39 20.75,53.45 K1.12
PI_IO1
  Top 0.203: IC1.4 26.78,48.15 25.56,49.37 21.75,49.37 21.07,50.05 K1.11
PI_IO2
  Top 0.203: IC1.3 27.43,48.45 26.04,49.85 24.13,49.85 23.61,50.37 K1.13
PI_IO3
  Top 0.203: IC1.1 28.73,46.67 28.1,47.31 28.1,48.74 26.15,50.69 K1.15
PI_IO4  (via drill 0.6)
  Top 0.203: IC2.2 38.07,34.26 40.01,36.2 v40.01,37.47
  Bottom 0.203: v40.01,37.47 40.01,38.1 39.05,39.05 39.05,48.26 39.37,48.58 50.16,48.58 51.55,49.96 K1.35
PI_IO5  (via drill 0.6)
  Top 0.203: IC2.3 37.77,34.91 39.05,36.2 v39.05,36.99
  Bottom 0.203: K1.33 49.01,49.65 48.26,49.05 39.05,49.05 38.42,48.42 38.42,38.73 39.05,38.1 v39.05,36.99
PI_IO6  (via drill 0.6)
  Top 0.203: IC2.4 37.47,35.56 38.1,36.2 v38.1,37.47
  Bottom 0.203: v38.1,37.47 38.1,38.1 37.78,38.42 37.78,38.73 37.78,48.58 38.73,49.53 45.72,49.53 46.47,50.28 K1.31
PI_IO7  (via drill 0.6)
  Top 0.203: IC2.5 36.84,36.21 37.15,36.51 v37.15,36.99
  Bottom 0.203: v37.15,36.99 37.15,48.74 38.42,50.01 43.5,50.01 43.93,50.44 K1.29
PI_RX  (1 unrouted)
  Top 0.203: K1.10 17.14,52.39 17.14,50.48 17.62,50.01 19.21,50.01 20.8,48.42 24.61,48.42 25.48,47.54 IC1.6
PI_SCL  (via drill 0.6)
  Top 0.203: IC5.8 52.34,31.48 52.07,31.75 51.44,31.75 50.64,30.96 v49.85,30.96 | IC4.8 40.92,25.28 41.12,25.08 v41.12,24.13 | v24.77,44.77 24.18,45.35 IC1.8 24.18,46.94 23.65,47.47 20.48,47.47 18.89,49.05 15.08,49.05 14.13,50.01 14.13,50.55 K1.5
  Bottom 0.203: v49.85,30.96 49.85,27.94 49.69,27.78 | 49.69,27.78 45.56,23.65 41.59,23.65 v41.12,24.13 40.64,23.65 35.56,23.65 34.77,24.45 34.77,32.38 28.89,38.26 27.62,38.26 25.88,40.01 25.88,41.91 24.77,43.02 v24.77,44.77 | IC6.P$1 49.05,28.42 49.69,27.78
PI_SDA  (via drill 0.6)
  Top 0.203: IC5.7 57.76,31.48 v57.71,31.43 | IC4.7 35.28,24.8 v34.29,23.81 | v23.65,44.77 23.53,44.96 IC1.9 23.53,46.63 23.18,46.99 20.32,46.99 18.73,48.58 14.92,48.58 13.49,50.01 12.13,50.01 K1.3
  Bottom 0.203: 50.8,31.75 49.37,31.75 48.9,31.27 48.42,31.27 IC6.P$6 | 50.8,31.75 51.75,32.7 57.15,32.7 57.71,32.15 v57.71,31.43 | 50.8,31.75 50.8,28.26 45.72,23.18 34.92,23.18 v34.29,23.81 34.29,32.07 28.57,37.78 27.3,37.78 25.4,39.69 25.4,41.59 23.65,43.34 v23.65,44.77
PI_TX
  Top 0.203: IC1.7 24.83,47.24 24.13,47.94 20.64,47.94 19.05,49.53 15.24,49.53 14.61,50.16 14.61,52.38 K1.8
RX  (via drill 0.6)
  Top 0.203: IC1.15 25.48,38.98 22.54,36.04 14.29,36.04 14.13,35.88 v13.49,35.88
  Bottom 0.203: v13.49,35.88 12.7,35.88 12.38,36.2 11.43,36.2 10.79,35.56 6.51,35.56 5.71,34.77 5.71,16.51 4.91,15.7 CON_SERIAL.1
SCL  (via drill 0.6)
  Top 0.203: v15.24,15.88 15.24,15.24 15.56,14.92 15.56,9.84 14.43,8.71 CON_I2C_0.1 | IC3.6 48.15,47.42 v48.58,46.99 | CON_I2C_2.1 CON_I2C_1.1 | IC1.13 24.18,41.33 v24.29,41.43
  Bottom 0.203: v15.24,15.88 15.24,16.19 16.35,17.14 16.35,35.72 17.3,36.67 19.84,36.67 23.5,40.32 23.5,40.64 v24.29,41.43 22.7,43.02 22.7,45.09 23.18,45.56 25.24,45.56 25.72,45.09 25.72,43.5 27.62,41.59 27.62,39.85 28.26,39.21 29.53,39.21 33.97,34.77 42.39,34.77 43.02,35.4 43.02,37.47 40.96,39.53 40.96,41.59 40.96,42.23 41.27,42.55 41.27,45.88 42.39,46.99 v48.58,46.99 | CON_I2C_1.1 CON_I2C_0.1
SDA  (via drill 0.6)
  Top 0.203: 16.03,7.46 16.03,14.92 16.35,15.24 v16.35,15.88 | v26.67,41.43 25.88,42.23 23.81,42.23 23.53,41.95 IC1.12 23.53,39.09 v23.5,39.05 | IC3.5 45.52,48.69 45.09,48.26 v45.09,44.93 | 16.03,7.46 15.29,6.71 CON_I2C_0.2 | 16.03,7.46 16.78,6.71 CON_I2C_1.2 CON_I2C_2.2
  Bottom 0.203: v23.5,39.05 20.64,36.2 17.46,36.2 16.83,35.56 16.83,16.35 v16.35,15.88 | v26.67,41.43 26.67,40.01 27.94,38.73 29.21,38.73 33.66,34.29 42.55,34.29 43.5,35.24 43.5,37.62 41.43,39.69 41.43,42.07 41.75,42.39 41.75,44.13 42.55,44.93 v45.09,44.93
TX  (via drill 0.6)
  Top 0.203: IC1.14 24.83,39.12 22.23,36.51 13.97,36.51 13.81,36.67 13.18,36.67 v11.91,35.4
  Bottom 0.203: v11.91,35.4 11.43,34.92 6.67,34.92 6.35,34.61 6.35,14.61 5.45,13.7 CON_SERIAL.2
VSS  (via drill 0.6)  (2 unrouted)
  Top 0.203: IC5.14 54.4,27.57 54.61,27.78 54.61,28.73 54.45,28.89 53.4,28.89 IC5.12 | IC4.2 35.31,29.53 36.2,29.53 36.51,29.21 36.51,28.42 36.35,28.26 IC4.4 34.45,28.26 33.97,27.78 33.97,27.62 35.24,27.62 | IC4.14 39.74,30.21 39.53,30 39.53,29.05 39.69,28.89 40.58,28.89 IC4.12 | IC5.4 58.1,29.53 57.78,29.21 57.78,28.23 | C4.2 30.16,47.3 30.16,48.74 29.53,48.74 | 30.8,26.67 30.8,27.62 31.43,28.26 | 40.96,28.89 41.75,28.89 43.34,27.3 44.61,27.3 | 33.97,30.8 36.2,30.8 36.51,30.48 36.51,29.69 | 32.23,20.16 arc-251 33.34,19.05 33.34,17.62 32.86,17.14 RB1.1 | 42.23,30.16 41.12,30.16 | C7.2 28.73,29.05 28.1,28.42
  Top 0.305: IC4.2 33.36,29.55 33.34,29.21 | IC5.2 57.78,28.23 57.49,28.23 57.47,28.26 | IC5.14 54.88,27.57 54.93,27.62 | IC1.11 22.88,40.3 22.86,40.16 21.59,40.16
  Top 0.61: 64.29,36.99 64.29,33.81
  Top 1.27: 32.38,32.38 32.38,34.29 | 28.1,28.42 27.15,28.42 | 28.1,12.86 27.3,12.86
  Bottom 1.27: 27.15,28.42 28.1,28.42 | 54.13,34.45 54.13,36.35 | 27.3,12.86 28.1,12.86
  other vias: 44.93,21.91 31.27,33.97 32.7,40.64 33.02,31.11 53.5,23.02 48.74,24.13 28.42,43.02 32.86,29.21 51.44,37.78 50.01,45.09 36.04,38.26 21.43,45.4 35.24,40.64 40.32,45.56 56.04,18.41 11.43,29.69 11.27,23.5 11.11,15.4 22.23,31.75 25.4,24.77 23.5,5.71 24.13,15.56 39.37,4.92 39.85,10.32 39.85,16.67 53.34,10.48 44.93,1.59 56.36,46.2 53.5,16.51 23.5,7.62 13.02,7.78 13.02,5.71 14.45,17.46 55.4,26.35
  pour Top (isolate 0.381): 0,3 arc90 3,0 27.6,0 27.46,33.66 39.69,33.66 41.66,35.63 65,35.63 65,53 arc90 62,56 3,56 arc90 0,53 0,37.5 arc90 1,36.5 4,36.5 arc-90 5,35.5 5,20.5 arc-90 4,19.5 1,19.5 arc90 0,18.5
  pour Bottom (isolate 0.381): 0,3 arc90 3,0 27.65,0.05 27.49,33.6 39.69,33.66 41.73,35.7 65,35.7 65,53 arc90 62,56 3,56 arc90 0,53 0,37.5 arc90 1,36.5 4,36.5 arc-90 5,35.5 5,20.5 arc-90 4,19.5 1,19.5 arc90 0,18.5
  pour Top (isolate 0.381): 28.26,0 46.99,0 61.91,0 arc95 65.09,3.49 65.09,34.92 42.23,34.92 40.01,32.7 28.26,32.7
  pour Bottom (isolate 0.381): 28.26,0 28.26,32.7 40.01,32.7 42.23,34.92 65.09,34.92 65.09,3.17 arc-90 61.91,0 43.18,0

### Text on the board
tPlace: 3V | 5V | GND | 5V | 5V | + | - | IO0 | IO4 | * | RaspiO'Mix+ | rev 2.0.2 | * | IO1 | IO5 | AN0 | AN4 | IO2 | IO6 | * | Serial | AN1 | AN5 | AN | IO3 | IO7 | * | 0 | 4 | 1 | 5 | 2 | 6 | * Push-pull only | AN2 | AN6 | 3 | 7 | I2C | x3 | AN3 | AN7
bPlace: IO0 | IO4 | ADR3 | www.digitalspirit.org | ADR1 | ADR2 | IO1 | IO5 | ADR0 | AN0 | AN4 | IO2 | IO6 | Serial | AN1 | AN5 | RX | IO3 | IO7 | TX | AN2 | AN6 | SCL | SDA | AN3 | AN7 | I2C | I2C | I2C
bNames: www.digitalspirit.org | 2014/11